# Altium schematic sheet IMU.SchDoc: IMU
size 420 x 297 mm; SheetNumber: 5
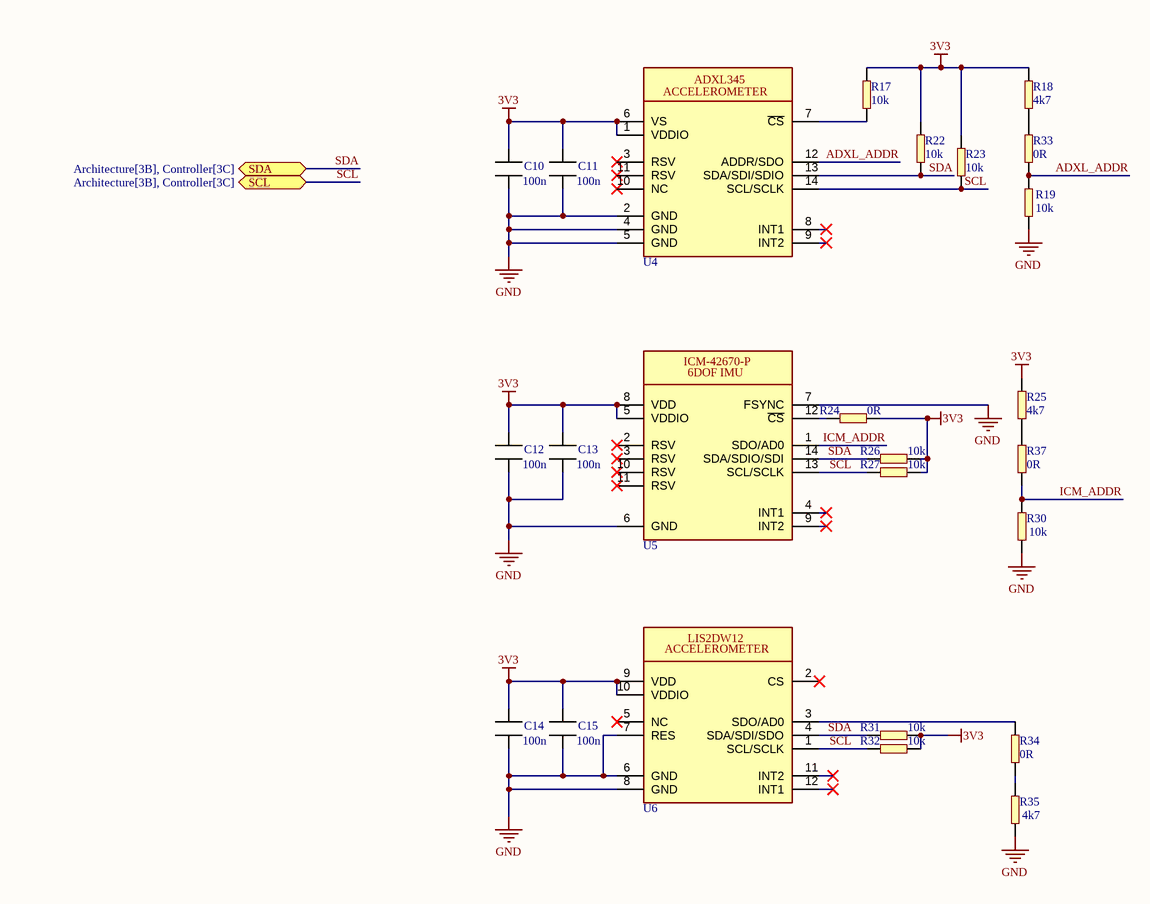
[diagram p0: IMU.SchDoc]

## Parts
C10  value 100n  [CAPC1608X10N]  (hidden comment: ERP_102-1)
C11  value 100n  [CAPC1608X10N]  (hidden comment: ERP_102-1)
C12  value 100n  [CAPC1608X10N]  (hidden comment: ERP_102-1)
C13  value 100n  [CAPC1608X10N]  (hidden comment: ERP_102-1)
C14  value 100n  [CAPC1608X10N]  (hidden comment: ERP_102-1)
C15  value 100n  [CAPC1608X10N]  (hidden comment: ERP_102-1)
R17  value 10k  [RES_0603]  (hidden comment: ERP_101-1)
R18  value 4k7  [RES_0603]  (hidden comment: ERP_101-1)
R19  value 10k  [RES_0603]  (hidden comment: ERP_101-1)
R22  value 10k  [RES_0603]  (hidden comment: ERP_101-1)
R23  value 10k  [RES_0603]  (hidden comment: ERP_101-1)
R24  value 0R  [RES_0603]  (hidden comment: ERP_101-1)
R25  value 4k7  [RES_0603]  (hidden comment: ERP_101-1)
R26  value 10k  [RES_0603]  (hidden comment: ERP_101-1)
R27  value 10k  [RES_0603]  (hidden comment: ERP_101-1)
R30  value 10k  [RES_0603]  (hidden comment: ERP_101-1)
R31  value 10k  [RES_0603]  (hidden comment: ERP_101-1)
R32  value 10k  [RES_0603]  (hidden comment: ERP_101-1)
R33  value 0R  [RES_0603]  (hidden comment: ERP_101-1)  (no BOM)
R34  value 0R  [RES_0603]  (hidden comment: ERP_101-1)  (no BOM)
R35  value 4k7  [RES_0603]  (hidden comment: ERP_101-1)
R37  value 0R  [RES_0603]  (hidden comment: ERP_101-1)  (no BOM)
U4  ADXL345  [ADXL345]  (value not drawn)
U5  ICM42670P  [ICM42670P]  (value not drawn)
U6  LIS2DW12  [LIS2DW12]  (value not drawn)

## Ports
SCL (bidir, see Architecture[3B], Controller[3C]), SDA (bidir, see Architecture[3B], Controller[3C])

## Nets
3V3: C10.1 C11.1 C12.1 C13.1 C14.1 C15.1 R17.2 R18.2 R22.2 R23.2 R24.1 R25.2 R26.1 R27.1 R31.1 R32.1 U4.1(VDDIO) U4.6(VS) U5.5(VDDIO) U5.8(VDD) U6.9(VDD) U6.10(VDDIO)
GND: C10.2 C11.2 C12.2 C13.2 C14.2 C15.2 R19.1 R30.1 R35.1 U4.2(GND) U4.4(GND) U4.5(GND) U5.6(GND) U5.7(FSYNC) U6.6(GND) U6.7(RES) U6.8(GND)
ADXL_ADDR: R19.2 R33.1 U4.12(ADDR/SDO)
ICM_ADDR: R30.2 R37.1 U5.1(SDO/AD0)
SCL: R23.1 R27.2 R32.2 U4.14(SCL/SCLK) U5.13(SCL/SCLK) U6.1(SCL/SCLK) ; port SCL
SDA: R22.1 R26.2 R31.2 U4.13(SDA/SDI/SDIO) U5.14(SDA/SDIO/SDI) U6.4(SDA/SDI/SDO) ; port SDA
NetR17_1: R17.1 U4.7(~{CS})
NetR18_1: R18.1 R33.2
NetR24_2: R24.2 U5.12(~{CS})
NetR25_1: R25.1 R37.2
NetR34_1: R34.1 R35.2
NetR34_2: R34.2 U6.3(SDO/AD0)

Not connected (* = marked no-connect by the designer): U4 3(RSV)* 8(INT1)* 9(INT2)* 10(NC)* 11(RSV)*; U5 2(RSV)* 3(RSV)* 4(INT1)* 9(INT2)* 10(RSV)* 11(RSV)*; U6 2(CS)* 5(NC)* 11(INT2)* 12(INT1)*

## Notes on the sheet
- PROJECT
- SIZE
- FILE NAME
- A3
- TITLE
- SHEET
- OF
- REV
- (in symbol ADXL345) ACCELEROMETER
- (in symbol ICM42670P) 6DOF IMU
- (in symbol LIS2DW12) ACCELEROMETER

## Library data of the parts
C10-C15 = MLCC_0603: Chip Capacitor, 2-Leads, Body 1.60x0.80mm, IPC Medium Density; Package: 0603; Manufacturer 1: *; Manufacturer Part Number 1: *; Supplier 1: *; Suuplier Part Number 1: *; ERP: *
R17-R19 R22-R27 R30-R35 R37 = RES_0603: Package: 0603; Manufacturer 1: *; Manufacturer Part Number 1: *; Supplier 1: *; Supplier Part Number 1: *; ERP: *
U4 = ADXL345: ACCEL 2-16G I2C/SPI 14LGA; Manufacturer 1: Analog Devices Inc.; Manufacturer Part Number 1: ADXL345BCCZ-RL7; Value: *
U5 = ICM42670P: IMU ACCEL/GYRO/TEMP I2C/SPI; Manufacturer Part Number 1: ICM-42670-P; Manufacturer 1: TDK InvenSense; Value: *
U6 = LIS2DW12: ACCEL 2-16G I2C/SPI 12LGA; Manufacturer 1: STMicroelectronics; Value: *; Manufacturer Part Number 1: *